# Altium project E17-PDU.PrjPcb
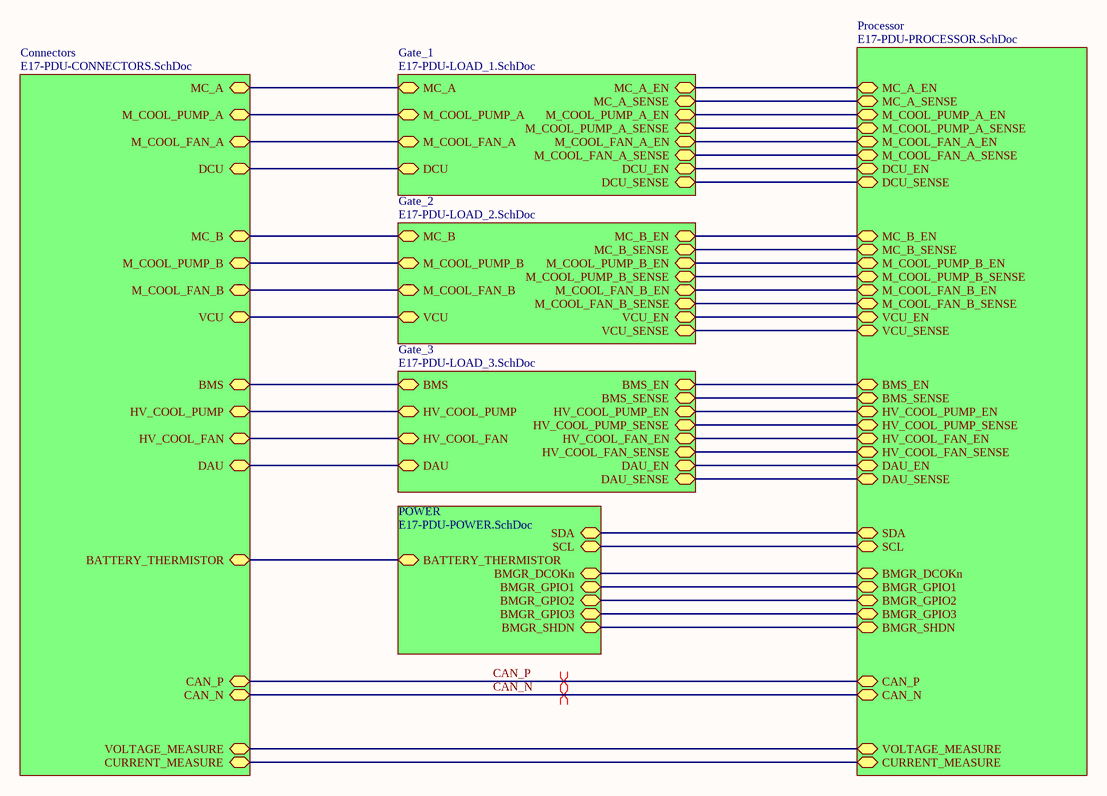
[diagram p0: E17-PDU-MASTER.SchDoc]
7 sheets, 173 parts. Net scope: hierarchical (ports join the sheet entries above them; power ports are global).
Board file: E17-PDU-LAYOUT.PcbDoc
Sheets:
  E17-PDU-MASTER.SchDoc
    Connectors = E17-PDU-CONNECTORS.SchDoc
    Processor = E17-PDU-PROCESSOR.SchDoc
    Gate_1 = E17-PDU-LOAD_1.SchDoc
    Gate_2 = E17-PDU-LOAD_2.SchDoc
    Gate_3 = E17-PDU-LOAD_3.SchDoc
    POWER = E17-PDU-POWER.SchDoc

## Sheet E17-PDU-MASTER.SchDoc
size B

### Sub-sheets
Connectors = E17-PDU-CONNECTORS.SchDoc: MC_A, M_COOL_PUMP_A, M_COOL_FAN_A, MC_B, M_COOL_PUMP_B, DCU, VCU, BMS, CAN_P, CAN_N, VOLTAGE_MEASURE, CURRENT_MEASURE, HV_COOL_PUMP, HV_COOL_FAN, M_COOL_FAN_B, DAU, BATTERY_THERMISTOR
Gate_1 = E17-PDU-LOAD_1.SchDoc: MC_A, M_COOL_PUMP_A, M_COOL_FAN_A, MC_A_EN, M_COOL_PUMP_A_EN, M_COOL_FAN_A_EN, MC_A_SENSE, M_COOL_PUMP_A_SENSE, M_COOL_FAN_A_SENSE, DCU, DCU_EN, DCU_SENSE
Gate_2 = E17-PDU-LOAD_2.SchDoc: MC_B, M_COOL_PUMP_B, MC_B_EN, M_COOL_PUMP_B_EN, MC_B_SENSE, M_COOL_PUMP_B_SENSE, VCU, VCU_EN, VCU_SENSE, M_COOL_FAN_B, M_COOL_FAN_B_EN, M_COOL_FAN_B_SENSE
Gate_3 = E17-PDU-LOAD_3.SchDoc: BMS, BMS_EN, BMS_SENSE, HV_COOL_PUMP_SENSE, HV_COOL_PUMP_EN, HV_COOL_FAN_SENSE, HV_COOL_FAN_EN, HV_COOL_PUMP, HV_COOL_FAN, DAU_EN, DAU, DAU_SENSE
POWER = E17-PDU-POWER.SchDoc: BATTERY_THERMISTOR, BMGR_DCOKn, BMGR_GPIO1, BMGR_GPIO2, BMGR_GPIO3, BMGR_SHDN, SDA, SCL
Processor = E17-PDU-PROCESSOR.SchDoc: MC_A_EN, M_COOL_PUMP_A_EN, M_COOL_FAN_A_EN, M_COOL_FAN_B_EN, MC_B_EN, M_COOL_PUMP_B_EN, DCU_EN, VCU_EN, BMS_EN, VOLTAGE_MEASURE, CURRENT_MEASURE, CAN_P, CAN_N, MC_A_SENSE, M_COOL_PUMP_A_SENSE, M_COOL_FAN_A_SENSE, M_COOL_FAN_B_SENSE, MC_B_SENSE, M_COOL_PUMP_B_SENSE, DCU_SENSE, VCU_SENSE, BMS_SENSE, HV_COOL_PUMP_SENSE, HV_COOL_PUMP_EN, HV_COOL_FAN_SENSE, HV_COOL_FAN_EN, DAU_EN, DAU_SENSE, BMGR_DCOKn, BMGR_GPIO1, BMGR_GPIO2, BMGR_GPIO3, BMGR_SHDN, SCL, SDA

### Nets
CAN_N: sheet Connectors/CAN_N, sheet Processor/CAN_N
CAN_P: sheet Connectors/CAN_P, sheet Processor/CAN_P
NetF5_2: sheet Connectors/MC_A, sheet Gate_1/MC_A
NetF6_2: sheet Connectors/M_COOL_PUMP_A, sheet Gate_1/M_COOL_PUMP_A
NetF7_2: sheet Connectors/M_COOL_FAN_A, sheet Gate_1/M_COOL_FAN_A
NetF8_2: sheet Connectors/DCU, sheet Gate_1/DCU
NetF9_2: sheet Connectors/MC_B, sheet Gate_2/MC_B
NetF10_2: sheet Connectors/M_COOL_PUMP_B, sheet Gate_2/M_COOL_PUMP_B
NetF11_2: sheet Connectors/M_COOL_FAN_B, sheet Gate_2/M_COOL_FAN_B
NetF12_2: sheet Connectors/VCU, sheet Gate_2/VCU
NetF13_2: sheet Connectors/BMS, sheet Gate_3/BMS
NetF14_2: sheet Connectors/HV_COOL_PUMP, sheet Gate_3/HV_COOL_PUMP
NetF15_2: sheet Connectors/HV_COOL_FAN, sheet Gate_3/HV_COOL_FAN
NetF16_2: sheet Connectors/DAU, sheet Gate_3/DAU
NetJ2_34: sheet Connectors/BATTERY_THERMISTOR, sheet POWER/BATTERY_THERMISTOR
NetPB1_16: sheet Connectors/VOLTAGE_MEASURE, sheet Processor/VOLTAGE_MEASURE
NetPB1_18: sheet Processor/MC_B_SENSE, sheet Gate_2/MC_B_SENSE
NetPB1_20: sheet Processor/M_COOL_PUMP_B_SENSE, sheet Gate_2/M_COOL_PUMP_B_SENSE
NetPB1_22: sheet Processor/M_COOL_FAN_B_SENSE, sheet Gate_2/M_COOL_FAN_B_SENSE
NetPB1_24: sheet Processor/VCU_SENSE, sheet Gate_2/VCU_SENSE
NetPB1_25: sheet Connectors/CURRENT_MEASURE, sheet Processor/CURRENT_MEASURE
NetPB1_26: sheet Processor/DCU_SENSE, sheet Gate_1/DCU_SENSE
NetPB1_27: sheet Processor/BMS_SENSE, sheet Gate_3/BMS_SENSE
NetPB1_28: sheet Processor/M_COOL_FAN_A_SENSE, sheet Gate_1/M_COOL_FAN_A_SENSE
NetPB1_29: sheet Processor/HV_COOL_PUMP_SENSE, sheet Gate_3/HV_COOL_PUMP_SENSE
NetPB1_30: sheet Processor/M_COOL_PUMP_A_SENSE, sheet Gate_1/M_COOL_PUMP_A_SENSE
NetPB1_31: sheet Processor/HV_COOL_FAN_SENSE, sheet Gate_3/HV_COOL_FAN_SENSE
NetPB1_32: sheet Processor/MC_A_SENSE, sheet Gate_1/MC_A_SENSE
NetPB1_33: sheet Processor/DAU_SENSE, sheet Gate_3/DAU_SENSE
NetPB1_36: sheet Processor/SCL, sheet POWER/SCL
NetPB1_38: sheet Processor/SDA, sheet POWER/SDA
NetPB1_39: sheet Processor/MC_B_EN, sheet Gate_2/MC_B_EN
NetPB1_40: sheet Processor/BMS_EN, sheet Gate_3/BMS_EN
NetPB1_41: sheet Processor/M_COOL_PUMP_B_EN, sheet Gate_2/M_COOL_PUMP_B_EN
NetPB1_42: sheet Processor/HV_COOL_PUMP_EN, sheet Gate_3/HV_COOL_PUMP_EN
NetPB1_44: sheet Processor/HV_COOL_FAN_EN, sheet Gate_3/HV_COOL_FAN_EN
NetPB1_46: sheet Processor/DAU_EN, sheet Gate_3/DAU_EN
NetPB1_47: sheet Processor/M_COOL_FAN_B_EN, sheet Gate_2/M_COOL_FAN_B_EN
NetPB1_49: sheet Processor/VCU_EN, sheet Gate_2/VCU_EN
NetPB1_53: sheet Processor/MC_A_EN, sheet Gate_1/MC_A_EN
NetPB1_55: sheet Processor/M_COOL_PUMP_A_EN, sheet Gate_1/M_COOL_PUMP_A_EN
NetPB1_56: sheet Processor/BMGR_DCOKn, sheet POWER/BMGR_DCOKn
NetPB1_57: sheet Processor/M_COOL_FAN_A_EN, sheet Gate_1/M_COOL_FAN_A_EN
NetPB1_58: sheet Processor/BMGR_GPIO3, sheet POWER/BMGR_GPIO3
NetPB1_59: sheet Processor/DCU_EN, sheet Gate_1/DCU_EN
NetPB1_60: sheet Processor/BMGR_GPIO2, sheet POWER/BMGR_GPIO2
NetPB1_62: sheet Processor/BMGR_GPIO1, sheet POWER/BMGR_GPIO1
NetPB1_64: sheet Processor/BMGR_SHDN, sheet POWER/BMGR_SHDN

### Layout directives
differential pair: CAN_N, CAN_P

## Sheet E17-PDU-CONNECTORS.SchDoc
size A3
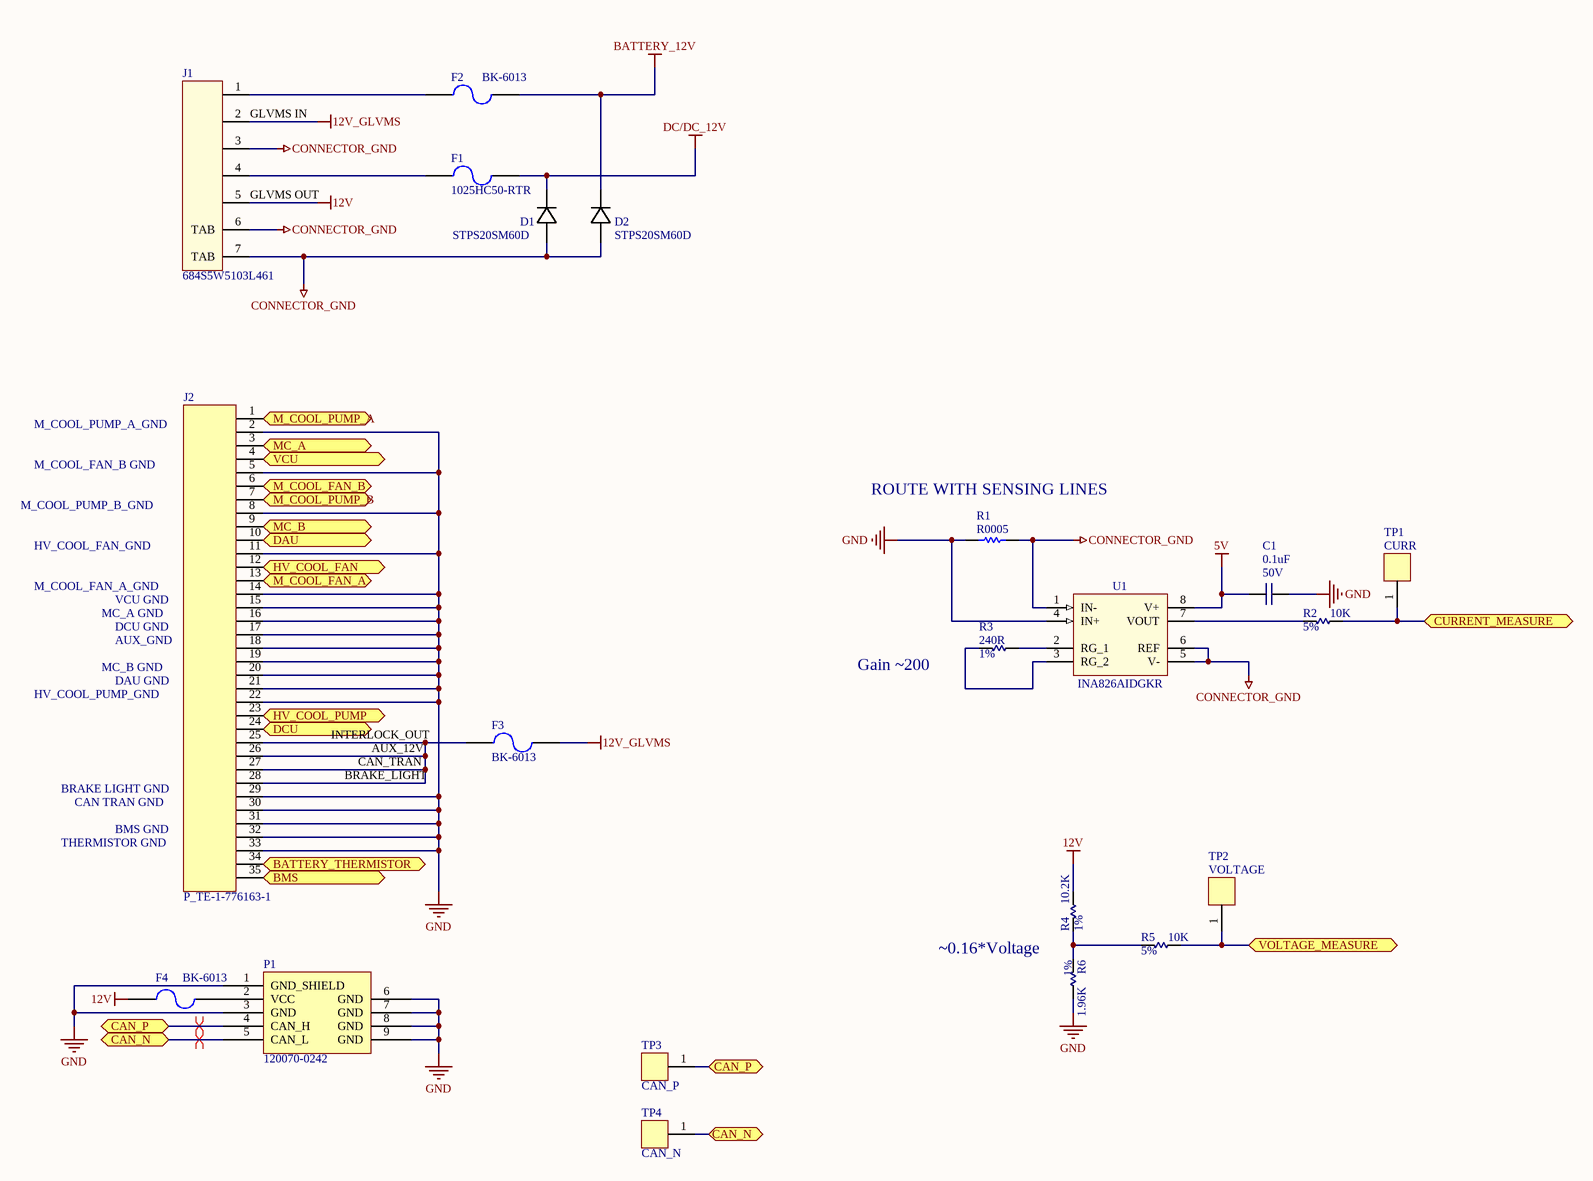
[diagram p1: E17-PDU-CONNECTORS.SchDoc]

### Parts
C1  value 0.1uF  Voltage: 50V  [C0805]  (hidden comment: C_0805_Generic)
D1  MFG_PN: STPS20SM60D  [TO-220-2]  (hidden comment: D_STPS20SM60D)
D2  MFG_PN: STPS20SM60D  [TO-220-2]  (hidden comment: D_STPS20SM60D)
F1  MFG_PN: 1025HC50-RTR  [F_1025HC50-RTR]  (hidden comment: F_1025HC50-RTR)
F2  F_BK-6013  [BK-6013]  (value not drawn)
F3  F_BK-6013  [BK-6013]  (value not drawn)
F4  F_BK-6013  [BK-6013]  (value not drawn)
J1  MFG_PN: 684S5W5103L461  [J_684S5W5103L461]  (hidden comment: J_684S5W5103L461)
J2  P_TE-1-776163-1  [P_TE-1-776163-1]
P1  MFG_PN: 120070-0242  [CAN Connector (90)]  (hidden comment: P_CAN-CONNECTOR)
R1  value R0005  [PSR500HTQFC0L20]  (hidden comment: R_PSR500HTQFC0L20)
R2  value 10K  Tolerance: 5%  [R0805]  (hidden comment: R_0805_Generic)
R3  value 240R  Tolerance: 1%  [R0805]  (hidden comment: R_0805_Generic)
R4  value 10.2K  Tolerance: 1%  [R0805]  (hidden comment: R_0805_Generic)
R5  value 10K  Tolerance: 5%  [R0805]  (hidden comment: R_0805_Generic)
R6  value 1.96K  Tolerance: 1%  [R0805]  (hidden comment: R_0805_Generic)
TP1  CURR  [TEST POINT]
TP2  VOLTAGE  [TEST POINT]
TP3  CAN_P  [TEST POINT]
TP4  CAN_N  [TEST POINT]
U1  value INA826AIDGKR  [8-TSSOP]  (hidden comment: U_INA826AIDGKR)

### Ports
BATTERY_THERMISTOR, BMS, CAN_N, CAN_P, CURRENT_MEASURE, DAU, DCU, HV_COOL_FAN, HV_COOL_PUMP, M_COOL_FAN_A, M_COOL_FAN_B, M_COOL_PUMP_A, M_COOL_PUMP_B, MC_A, MC_B, VCU, VOLTAGE_MEASURE

### Nets
5V: C1.2 U1.8(V+)
12V: F4.2 J1.5 R4.2
12V_GLVMS: F3.2 J1.2
BATTERY_12V: D2.2 F2.2
CONNECTOR_GND: D1.1 D2.1 J1.3 J1.6(TAB) J1.7(TAB) R1.2 U1.1(IN-) U1.5(V-) U1.6(REF)
DC/DC_12V: D1.2 F1.2
GND: C1.1(EGND) J2.2 J2.5 J2.8 J2.11 J2.14 J2.15 J2.16 J2.17 J2.18 J2.19 J2.20 J2.21 J2.22 J2.29 J2.30 J2.31 J2.32 J2.33 P1.1(GND_SHIELD) P1.3(GND) P1.6(GND) P1.7(GND) P1.8(GND) P1.9(GND) R1.1 R6.2 U1.4(IN+)
CAN_N: P1.5(CAN_L) TP4.1 ; port CAN_N
CAN_P: P1.4(CAN_H) TP3.1 ; port CAN_P
NetF1_1: F1.1 J1.4
NetF2_1: F2.1 J1.1
NetF3_1: F3.1 J2.25 J2.26 J2.27 J2.28
NetF4_1: F4.1 P1.2(VCC)
NetF5_2: J2.3 ; port MC_A
NetF6_2: J2.1 ; port M_COOL_PUMP_A
NetF7_2: J2.13 ; port M_COOL_FAN_A
NetF8_2: J2.24 ; port DCU
NetF9_2: J2.9 ; port MC_B
NetF10_2: J2.7 ; port M_COOL_PUMP_B
NetF11_2: J2.6 ; port M_COOL_FAN_B
NetF12_2: J2.4 ; port VCU
NetF13_2: J2.35 ; port BMS
NetF14_2: J2.23 ; port HV_COOL_PUMP
NetF15_2: J2.12 ; port HV_COOL_FAN
NetF16_2: J2.10 ; port DAU
NetJ2_34: J2.34 ; port BATTERY_THERMISTOR
NetPB1_16: R5.2 TP2.1 ; port VOLTAGE_MEASURE
NetPB1_25: R2.2 TP1.1 ; port CURRENT_MEASURE
NetR2_1: R2.1 U1.7(VOUT)
NetR3_1: R3.1 U1.3(RG_2)
NetR3_2: R3.2 U1.2(RG_1)
NetR4_1: R4.1 R5.1 R6.1

### Layout directives
differential pair: CAN_N, CAN_P

### Notes on the sheet
- (near J1) GLVMS IN
- (near J1) GLVMS OUT
- M_COOL_FAN_B GND
- M_COOL_PUMP_A_GND
- M_COOL_PUMP_B_GND
- (near R1) ROUTE WITH SENSING LINES
- HV_COOL_FAN_GND
- M_COOL_FAN_A_GND
- VCU GND
- MC_A GND
- MC_B GND
- DCU GND
- AUX_GND
- Gain ~200
- HV_COOL_PUMP_GND
- DAU GND
- INTERLOCK_OUT
- BRAKE LIGHT GND
- CAN TRAN GND
- BRAKE_LIGHT
- CAN_TRAN
- AUX_12V
- THERMISTOR GND
- BMS GND
- ~0.16*Voltage

### Library data of the parts
C1 = C_0805_Generic: Generic 0805 Capacitor; Tolerance: 10%; Supplier: Digikey; Supplier_PN: 399-1170-1-ND
D1 D2 = D_STPS20SM60D: DIODE 630mV 20A cts 60V; MFG: ST; Supplier: Digikey; Supplier_PN: 497-12305-ND
F1 = F_1025HC50-RTR: FUSE 50A 60VDC; MFG: Eaton; Supplier: Digikey; Supplier_PN: 283-4682-1-ND
F2-F4 = F_BK-6013: FUSE HOLDER BLADE PCB; MFG: MPD; Supplier: Digikey; Supplier_PN: BK-6013-ND; MFG_PN: BK-6013
J1 = J_684S5W5103L461: D-Sub 5-pin 40A RA TH; MFG: NorComp; Supplier: Digikey; Supplier_PN: NOR1213-ND
J2 = P_TE-1-776163-1: CONN HEADER 35POS R/A GOLD BLACK; MFG: TE; Supplier_PN: A106383-ND; Supplier: Digikey; MFG_PN: 1-776163-1
P1 = P_CAN-CONNECTOR: MFG: MOLEX
R1 = R_PSR500HTQFC0L20: Resistor 0.0002ohm 5W Current Sense; MFG: Rohm; MFG_PN: PSR500HTQFC0L20; Supplier: Digikey; Supplier_PN: RHM1679-CT-ND
R2-R6 = R_0805_Generic: Generic 0805 Resistor; Power: 1/8W; Supplier: Digikey
  R2 R5: Supplier_PN: P10KACT-ND
  R3: Supplier_PN: P240CCT-ND
  R4: Supplier_PN: P10.2KCCT-ND
  R6: Supplier_PN: P1.96KCCT-ND
TP1-TP4 = Test Point
U1 = U_INA826AIDGKR: Opamp Instrumentation 2.7-36V SS; MFG: TI; MFG_PN: INA826AIDGKR; Supplier 1: Digi-Key; Supplier Part Number 1: 296-29663-1-ND

## Sheet E17-PDU-PROCESSOR.SchDoc
size A4
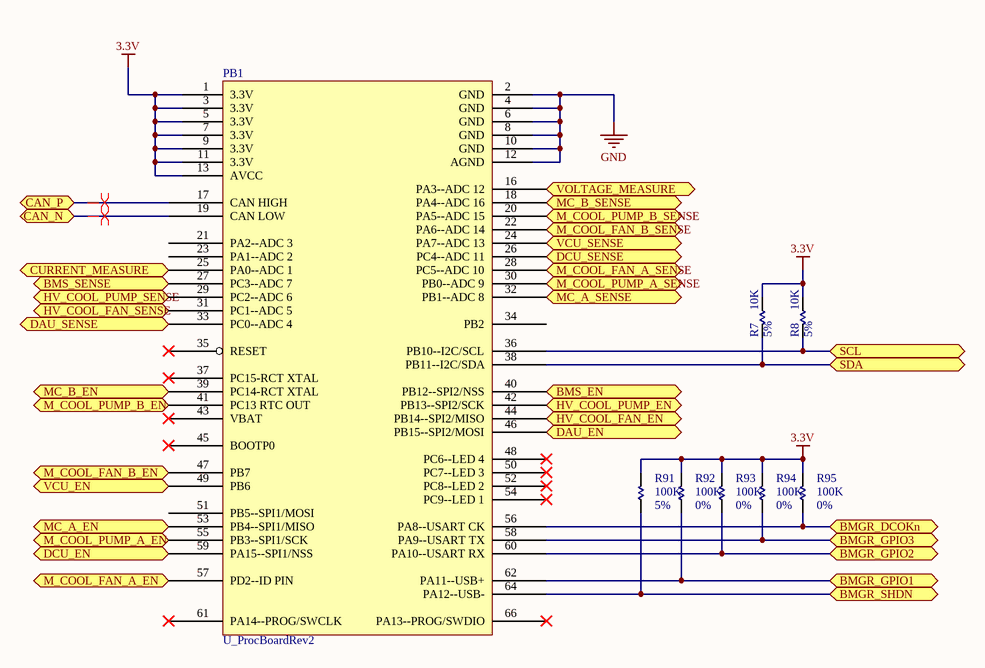
[diagram p2: E17-PDU-PROCESSOR.SchDoc]

### Parts
PB1  U_ProcBoardRev2  [PROC_BOARD]
R7  value 10K  Tolerance: 5%  [R0603]  (hidden comment: R_0603_Generic)
R8  value 10K  Tolerance: 5%  [R0603]  (hidden comment: R_0603_Generic)
R91  value 100K  Tolerance: 5%  [R0603]  (hidden comment: R_0603_Generic)
R92  value 100K  Tolerance: 0%  [R0603]  (hidden comment: R_0603_Generic)
R93  value 100K  Tolerance: 0%  [R0603]  (hidden comment: R_0603_Generic)
R94  value 100K  Tolerance: 0%  [R0603]  (hidden comment: R_0603_Generic)
R95  value 100K  Tolerance: 0%  [R0603]  (hidden comment: R_0603_Generic)

### Ports
BMGR_DCOKn, BMGR_GPIO1, BMGR_GPIO2, BMGR_GPIO3, BMGR_SHDN, BMS_EN, BMS_SENSE, CAN_N, CAN_P, CURRENT_MEASURE, DAU_EN, DAU_SENSE, DCU_EN, DCU_SENSE, HV_COOL_FAN_EN, HV_COOL_FAN_SENSE, HV_COOL_PUMP_EN, HV_COOL_PUMP_SENSE, M_COOL_FAN_A_EN, M_COOL_FAN_A_SENSE, M_COOL_FAN_B_EN, M_COOL_FAN_B_SENSE, M_COOL_PUMP_A_EN, M_COOL_PUMP_A_SENSE, M_COOL_PUMP_B_EN, M_COOL_PUMP_B_SENSE, MC_A_EN, MC_A_SENSE, MC_B_EN, MC_B_SENSE, SCL, SDA, VCU_EN, VCU_SENSE, VOLTAGE_MEASURE

### Nets
3.3V: PB1.1(3.3V) PB1.3(3.3V) PB1.5(3.3V) PB1.7(3.3V) PB1.9(3.3V) PB1.11(3.3V) PB1.13(AVCC) R7.2 R8.2 R91.1 R92.1 R93.1 R94.1 R95.1
GND: PB1.2(GND) PB1.4(GND) PB1.6(GND) PB1.8(GND) PB1.10(GND) PB1.12(AGND)
CAN_N: PB1.19(CAN_LOW) ; port CAN_N
CAN_P: PB1.17(CAN_HIGH) ; port CAN_P
NetPB1_16: PB1.16(PA3--ADC_12) ; port VOLTAGE_MEASURE
NetPB1_18: PB1.18(PA4--ADC_16) ; port MC_B_SENSE
NetPB1_20: PB1.20(PA5--ADC_15) ; port M_COOL_PUMP_B_SENSE
NetPB1_22: PB1.22(PA6--ADC_14) ; port M_COOL_FAN_B_SENSE
NetPB1_24: PB1.24(PA7--ADC_13) ; port VCU_SENSE
NetPB1_25: PB1.25(PA0--ADC_1) ; port CURRENT_MEASURE
NetPB1_26: PB1.26(PC4--ADC_11) ; port DCU_SENSE
NetPB1_27: PB1.27(PC3--ADC_7) ; port BMS_SENSE
NetPB1_28: PB1.28(PC5--ADC_10) ; port M_COOL_FAN_A_SENSE
NetPB1_29: PB1.29(PC2--ADC_6) ; port HV_COOL_PUMP_SENSE
NetPB1_30: PB1.30(PB0--ADC_9) ; port M_COOL_PUMP_A_SENSE
NetPB1_31: PB1.31(PC1--ADC_5) ; port HV_COOL_FAN_SENSE
NetPB1_32: PB1.32(PB1--ADC_8) ; port MC_A_SENSE
NetPB1_33: PB1.33(PC0--ADC_4) ; port DAU_SENSE
NetPB1_36: PB1.36(PB10--I2C/SCL) R8.1 ; port SCL
NetPB1_38: PB1.38(PB11--I2C/SDA) R7.1 ; port SDA
NetPB1_39: PB1.39(PC14-RCT_XTAL) ; port MC_B_EN
NetPB1_40: PB1.40(PB12--SPI2/NSS) ; port BMS_EN
NetPB1_41: PB1.41(PC13_RTC_OUT) ; port M_COOL_PUMP_B_EN
NetPB1_42: PB1.42(PB13--SPI2/SCK) ; port HV_COOL_PUMP_EN
NetPB1_44: PB1.44(PB14--SPI2/MISO) ; port HV_COOL_FAN_EN
NetPB1_46: PB1.46(PB15--SPI2/MOSI) ; port DAU_EN
NetPB1_47: PB1.47(PB7) ; port M_COOL_FAN_B_EN
NetPB1_49: PB1.49(PB6) ; port VCU_EN
NetPB1_53: PB1.53(PB4--SPI1/MISO) ; port MC_A_EN
NetPB1_55: PB1.55(PB3--SPI1/SCK) ; port M_COOL_PUMP_A_EN
NetPB1_56: PB1.56(PA8--USART_CK) R95.2 ; port BMGR_DCOKn
NetPB1_57: PB1.57(PD2--ID_PIN) ; port M_COOL_FAN_A_EN
NetPB1_58: PB1.58(PA9--USART_TX) R94.2 ; port BMGR_GPIO3
NetPB1_59: PB1.59(PA15--SPI1/NSS) ; port DCU_EN
NetPB1_60: PB1.60(PA10--USART_RX) R93.2 ; port BMGR_GPIO2
NetPB1_62: PB1.62(PA11--USB+) R92.2 ; port BMGR_GPIO1
NetPB1_64: PB1.64(PA12--USB-) R91.2 ; port BMGR_SHDN

Not connected (* = marked no-connect by the designer): PB1 14(NC) 15(NC) 21(PA2--ADC_3) 23(PA1--ADC_2) 34(PB2) 35(RESET)* 37(PC15-RCT_XTAL)* 43(VBAT)* 45(BOOTP0)* 48(PC6--LED_4)* 50(PC7--LED_3)* 51(PB5--SPI1/MOSI) 52(PC8--LED_2)* 54(PC9--LED_1)* 61(PA14--PROG/SWCLK)* 63(NC) 65(NC) 66(PA13--PROG/SWDIO)* 67

### Layout directives
differential pair: CAN_N, CAN_P

### Library data of the parts
PB1 = U_ProcBoardRev2: Processor board that carries the STM32F072RB
R7 R8 = R_0603_Generic: Generic 0603 Resistor; Power: 1/10W; Supplier: Digikey; Supplier_PN: P10KGCT-ND
R91-R95 = R_0603_Generic: Generic 0603 Resistor; Power: 0W; Supplier: Digikey; Supplier_PN: 000-00-00-ND

## Sheet E17-PDU-LOAD_1.SchDoc
size A4
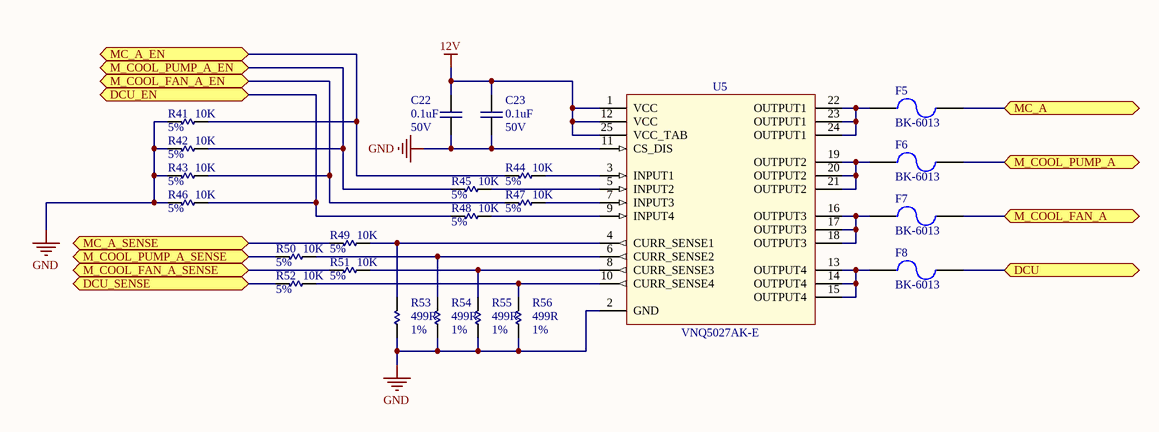
[diagram p3: E17-PDU-LOAD_1.SchDoc]

### Parts
C22  value 0.1uF  Voltage: 50V  [C0805]  (hidden comment: C_0805_Generic)
C23  value 0.1uF  Voltage: 50V  [C0805]  (hidden comment: C_0805_Generic)
F5  F_BK-6013  [BK-6013]  (value not drawn)
F6  F_BK-6013  [BK-6013]  (value not drawn)
F7  F_BK-6013  [BK-6013]  (value not drawn)
F8  F_BK-6013  [BK-6013]  (value not drawn)
R41  value 10K  Tolerance: 5%  [R0603]  (hidden comment: R_0603_Generic)
R42  value 10K  Tolerance: 5%  [R0603]  (hidden comment: R_0603_Generic)
R43  value 10K  Tolerance: 5%  [R0603]  (hidden comment: R_0603_Generic)
R44  value 10K  Tolerance: 5%  [R0603]  (hidden comment: R_0603_Generic)
R45  value 10K  Tolerance: 5%  [R0603]  (hidden comment: R_0603_Generic)
R46  value 10K  Tolerance: 5%  [R0603]  (hidden comment: R_0603_Generic)
R47  value 10K  Tolerance: 5%  [R0603]  (hidden comment: R_0603_Generic)
R48  value 10K  Tolerance: 5%  [R0603]  (hidden comment: R_0603_Generic)
R49  value 10K  Tolerance: 5%  [R0603]  (hidden comment: R_0603_Generic)
R50  value 10K  Tolerance: 5%  [R0603]  (hidden comment: R_0603_Generic)
R51  value 10K  Tolerance: 5%  [R0603]  (hidden comment: R_0603_Generic)
R52  value 10K  Tolerance: 5%  [R0603]  (hidden comment: R_0603_Generic)
R53  value 499R  Tolerance: 1%  [R0603]  (hidden comment: R_0603_Generic)
R54  value 499R  Tolerance: 1%  [R0603]  (hidden comment: R_0603_Generic)
R55  value 499R  Tolerance: 1%  [R0603]  (hidden comment: R_0603_Generic)
R56  value 499R  Tolerance: 1%  [R0603]  (hidden comment: R_0603_Generic)
U5  MFG_PN: VNQ5027AK-E  [PowerSSO-24]  (hidden comment: U_VNQ5027AK-E)

### Ports
DCU, DCU_EN, DCU_SENSE, M_COOL_FAN_A, M_COOL_FAN_A_EN, M_COOL_FAN_A_SENSE, M_COOL_PUMP_A, M_COOL_PUMP_A_EN, M_COOL_PUMP_A_SENSE, MC_A, MC_A_EN, MC_A_SENSE

### Nets
12V: C22.1(EGND) C23.1(EGND) U5.1(VCC) U5.12(VCC) U5.25(VCC_TAB)
GND: C22.2 C23.2 R41.1 R42.1 R43.1 R46.1 R53.2 R54.2 R55.2 R56.2 U5.2(GND) U5.11(CS_DIS)
NetF5_1: F5.1 U5.22(OUTPUT1) U5.23(OUTPUT1) U5.24(OUTPUT1)
NetF5_2: F5.2 ; port MC_A
NetF6_1: F6.1 U5.19(OUTPUT2) U5.20(OUTPUT2) U5.21(OUTPUT2)
NetF6_2: F6.2 ; port M_COOL_PUMP_A
NetF7_1: F7.1 U5.16(OUTPUT3) U5.17(OUTPUT3) U5.18(OUTPUT3)
NetF7_2: F7.2 ; port M_COOL_FAN_A
NetF8_1: F8.1 U5.13(OUTPUT4) U5.14(OUTPUT4) U5.15(OUTPUT4)
NetF8_2: F8.2 ; port DCU
NetPB1_26: R52.1 ; port DCU_SENSE
NetPB1_28: R51.1 ; port M_COOL_FAN_A_SENSE
NetPB1_30: R50.1 ; port M_COOL_PUMP_A_SENSE
NetPB1_32: R49.1 ; port MC_A_SENSE
NetPB1_53: R41.2 R44.1 ; port MC_A_EN
NetPB1_55: R42.2 R45.1 ; port M_COOL_PUMP_A_EN
NetPB1_57: R43.2 R47.1 ; port M_COOL_FAN_A_EN
NetPB1_59: R46.2 R48.1 ; port DCU_EN
NetR44_2: R44.2 U5.3(INPUT1)
NetR45_2: R45.2 U5.5(INPUT2)
NetR47_2: R47.2 U5.7(INPUT3)
NetR48_2: R48.2 U5.9(INPUT4)
NetR49_2: R49.2 R53.1 U5.4(CURR_SENSE1)
NetR50_2: R50.2 R54.1 U5.6(CURR_SENSE2)
NetR51_2: R51.2 R55.1 U5.8(CURR_SENSE3)
NetR52_2: R52.2 R56.1 U5.10(CURR_SENSE4)

### Library data of the parts
C22 C23 = C_0805_Generic: Generic 0805 Capacitor; Tolerance: 10%; Supplier: Digikey; Supplier_PN: 399-1170-1-ND
F5-F8 = F_BK-6013: FUSE HOLDER BLADE PCB; MFG: MPD; Supplier: Digikey; Supplier_PN: BK-6013-ND; MFG_PN: BK-6013
R41-R52 = R_0603_Generic: Generic 0603 Resistor; Power: 1/10W; Supplier: Digikey; Supplier_PN: P10KGCT-ND
R53-R56 = R_0603_Generic: Generic 0603 Resistor; Power: 1/8W; Supplier: Digikey; Supplier_PN: RNCP0603FTD499RCT-ND
U5 = U_VNQ5027AK-E: LOAD CHANNEL HIGH SIDE 42A 4 Channel; MFG: STmicroelectronics; Supplier_PN: 497-11715-1-ND; Supplier: Digikey

## Sheet E17-PDU-LOAD_2.SchDoc
size A4
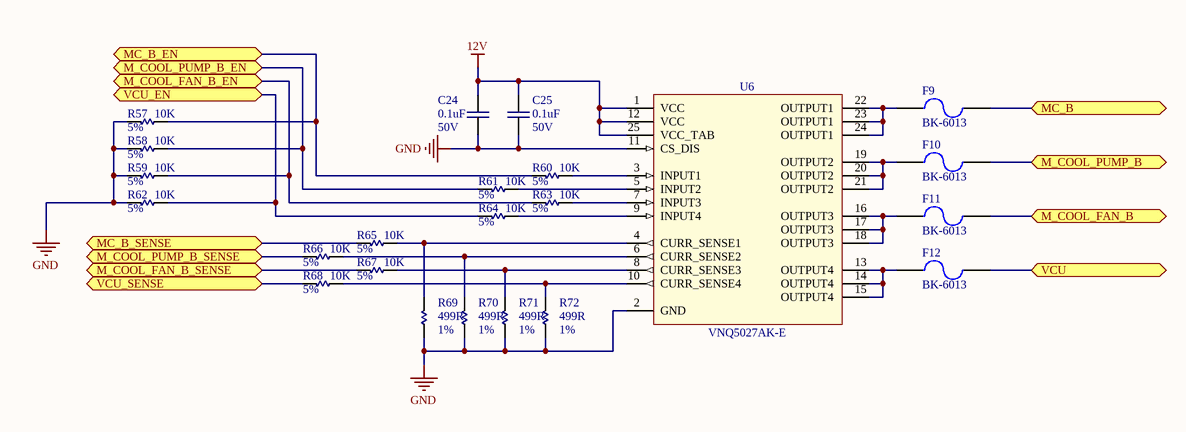
[diagram p4: E17-PDU-LOAD_2.SchDoc]

### Parts
C24  value 0.1uF  Voltage: 50V  [C0805]  (hidden comment: C_0805_Generic)
C25  value 0.1uF  Voltage: 50V  [C0805]  (hidden comment: C_0805_Generic)
F9  F_BK-6013  [BK-6013]  (value not drawn)
F10  F_BK-6013  [BK-6013]  (value not drawn)
F11  F_BK-6013  [BK-6013]  (value not drawn)
F12  F_BK-6013  [BK-6013]  (value not drawn)
R57  value 10K  Tolerance: 5%  [R0603]  (hidden comment: R_0603_Generic)
R58  value 10K  Tolerance: 5%  [R0603]  (hidden comment: R_0603_Generic)
R59  value 10K  Tolerance: 5%  [R0603]  (hidden comment: R_0603_Generic)
R60  value 10K  Tolerance: 5%  [R0603]  (hidden comment: R_0603_Generic)
R61  value 10K  Tolerance: 5%  [R0603]  (hidden comment: R_0603_Generic)
R62  value 10K  Tolerance: 5%  [R0603]  (hidden comment: R_0603_Generic)
R63  value 10K  Tolerance: 5%  [R0603]  (hidden comment: R_0603_Generic)
R64  value 10K  Tolerance: 5%  [R0603]  (hidden comment: R_0603_Generic)
R65  value 10K  Tolerance: 5%  [R0603]  (hidden comment: R_0603_Generic)
R66  value 10K  Tolerance: 5%  [R0603]  (hidden comment: R_0603_Generic)
R67  value 10K  Tolerance: 5%  [R0603]  (hidden comment: R_0603_Generic)
R68  value 10K  Tolerance: 5%  [R0603]  (hidden comment: R_0603_Generic)
R69  value 499R  Tolerance: 1%  [R0603]  (hidden comment: R_0603_Generic)
R70  value 499R  Tolerance: 1%  [R0603]  (hidden comment: R_0603_Generic)
R71  value 499R  Tolerance: 1%  [R0603]  (hidden comment: R_0603_Generic)
R72  value 499R  Tolerance: 1%  [R0603]  (hidden comment: R_0603_Generic)
U6  MFG_PN: VNQ5027AK-E  [PowerSSO-24]  (hidden comment: U_VNQ5027AK-E)

### Ports
M_COOL_FAN_B, M_COOL_FAN_B_EN, M_COOL_FAN_B_SENSE, M_COOL_PUMP_B, M_COOL_PUMP_B_EN, M_COOL_PUMP_B_SENSE, MC_B, MC_B_EN, MC_B_SENSE, VCU, VCU_EN, VCU_SENSE

### Nets
12V: C24.1(EGND) C25.1(EGND) U6.1(VCC) U6.12(VCC) U6.25(VCC_TAB)
GND: C24.2 C25.2 R57.1 R58.1 R59.1 R62.1 R69.2 R70.2 R71.2 R72.2 U6.2(GND) U6.11(CS_DIS)
NetF9_1: F9.1 U6.22(OUTPUT1) U6.23(OUTPUT1) U6.24(OUTPUT1)
NetF9_2: F9.2 ; port MC_B
NetF10_1: F10.1 U6.19(OUTPUT2) U6.20(OUTPUT2) U6.21(OUTPUT2)
NetF10_2: F10.2 ; port M_COOL_PUMP_B
NetF11_1: F11.1 U6.16(OUTPUT3) U6.17(OUTPUT3) U6.18(OUTPUT3)
NetF11_2: F11.2 ; port M_COOL_FAN_B
NetF12_1: F12.1 U6.13(OUTPUT4) U6.14(OUTPUT4) U6.15(OUTPUT4)
NetF12_2: F12.2 ; port VCU
NetPB1_18: R65.1 ; port MC_B_SENSE
NetPB1_20: R66.1 ; port M_COOL_PUMP_B_SENSE
NetPB1_22: R67.1 ; port M_COOL_FAN_B_SENSE
NetPB1_24: R68.1 ; port VCU_SENSE
NetPB1_39: R57.2 R60.1 ; port MC_B_EN
NetPB1_41: R58.2 R61.1 ; port M_COOL_PUMP_B_EN
NetPB1_47: R59.2 R63.1 ; port M_COOL_FAN_B_EN
NetPB1_49: R62.2 R64.1 ; port VCU_EN
NetR60_2: R60.2 U6.3(INPUT1)
NetR61_2: R61.2 U6.5(INPUT2)
NetR63_2: R63.2 U6.7(INPUT3)
NetR64_2: R64.2 U6.9(INPUT4)
NetR65_2: R65.2 R69.1 U6.4(CURR_SENSE1)
NetR66_2: R66.2 R70.1 U6.6(CURR_SENSE2)
NetR67_2: R67.2 R71.1 U6.8(CURR_SENSE3)
NetR68_2: R68.2 R72.1 U6.10(CURR_SENSE4)

### Library data of the parts
C24 C25 = C_0805_Generic: Generic 0805 Capacitor; Tolerance: 10%; Supplier: Digikey; Supplier_PN: 399-1170-1-ND
F9-F12 = F_BK-6013: FUSE HOLDER BLADE PCB; MFG: MPD; Supplier: Digikey; Supplier_PN: BK-6013-ND; MFG_PN: BK-6013
R57-R68 = R_0603_Generic: Generic 0603 Resistor; Power: 1/10W; Supplier: Digikey; Supplier_PN: P10KGCT-ND
R69-R72 = R_0603_Generic: Generic 0603 Resistor; Power: 1/8W; Supplier: Digikey; Supplier_PN: RNCP0603FTD499RCT-ND
U6 = U_VNQ5027AK-E: as U5 on sheet E17-PDU-LOAD_1; Supplier_PN: 497-11715-1-ND; Supplier: Digikey

## Sheet E17-PDU-LOAD_3.SchDoc
size A4
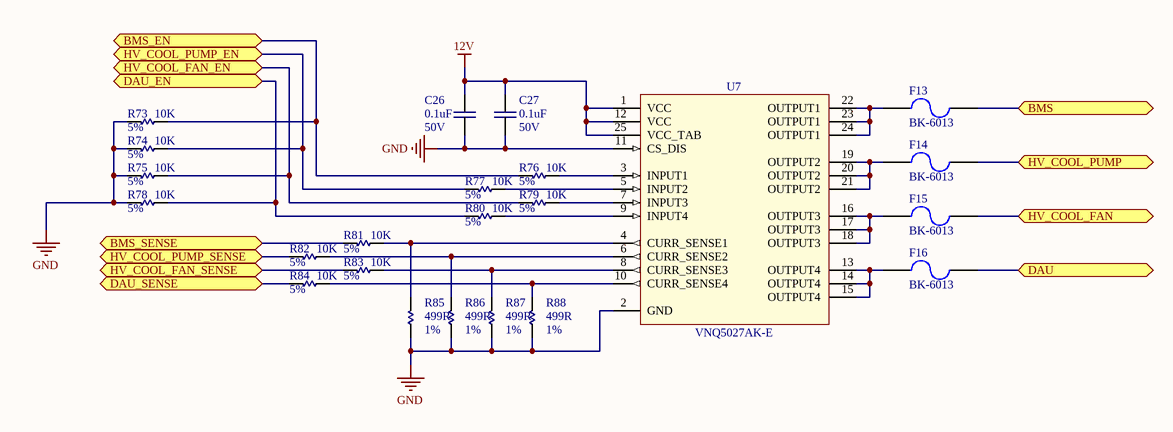
[diagram p5: E17-PDU-LOAD_3.SchDoc]

### Parts
C26  value 0.1uF  Voltage: 50V  [C0805]  (hidden comment: C_0805_Generic)
C27  value 0.1uF  Voltage: 50V  [C0805]  (hidden comment: C_0805_Generic)
F13  F_BK-6013  [BK-6013]  (value not drawn)
F14  F_BK-6013  [BK-6013]  (value not drawn)
F15  F_BK-6013  [BK-6013]  (value not drawn)
F16  F_BK-6013  [BK-6013]  (value not drawn)
R73  value 10K  Tolerance: 5%  [R0603]  (hidden comment: R_0603_Generic)
R74  value 10K  Tolerance: 5%  [R0603]  (hidden comment: R_0603_Generic)
R75  value 10K  Tolerance: 5%  [R0603]  (hidden comment: R_0603_Generic)
R76  value 10K  Tolerance: 5%  [R0603]  (hidden comment: R_0603_Generic)
R77  value 10K  Tolerance: 5%  [R0603]  (hidden comment: R_0603_Generic)
R78  value 10K  Tolerance: 5%  [R0603]  (hidden comment: R_0603_Generic)
R79  value 10K  Tolerance: 5%  [R0603]  (hidden comment: R_0603_Generic)
R80  value 10K  Tolerance: 5%  [R0603]  (hidden comment: R_0603_Generic)
R81  value 10K  Tolerance: 5%  [R0603]  (hidden comment: R_0603_Generic)
R82  value 10K  Tolerance: 5%  [R0603]  (hidden comment: R_0603_Generic)
R83  value 10K  Tolerance: 5%  [R0603]  (hidden comment: R_0603_Generic)
R84  value 10K  Tolerance: 5%  [R0603]  (hidden comment: R_0603_Generic)
R85  value 499R  Tolerance: 1%  [R0603]  (hidden comment: R_0603_Generic)
R86  value 499R  Tolerance: 1%  [R0603]  (hidden comment: R_0603_Generic)
R87  value 499R  Tolerance: 1%  [R0603]  (hidden comment: R_0603_Generic)
R88  value 499R  Tolerance: 1%  [R0603]  (hidden comment: R_0603_Generic)
U7  MFG_PN: VNQ5027AK-E  [PowerSSO-24]  (hidden comment: U_VNQ5027AK-E)

### Ports
BMS, BMS_EN, BMS_SENSE, DAU, DAU_EN, DAU_SENSE, HV_COOL_FAN, HV_COOL_FAN_EN, HV_COOL_FAN_SENSE, HV_COOL_PUMP, HV_COOL_PUMP_EN, HV_COOL_PUMP_SENSE

### Nets
12V: C26.1(EGND) C27.1(EGND) U7.1(VCC) U7.12(VCC) U7.25(VCC_TAB)
GND: C26.2 C27.2 R73.1 R74.1 R75.1 R78.1 R85.2 R86.2 R87.2 R88.2 U7.2(GND) U7.11(CS_DIS)
NetF13_1: F13.1 U7.22(OUTPUT1) U7.23(OUTPUT1) U7.24(OUTPUT1)
NetF13_2: F13.2 ; port BMS
NetF14_1: F14.1 U7.19(OUTPUT2) U7.20(OUTPUT2) U7.21(OUTPUT2)
NetF14_2: F14.2 ; port HV_COOL_PUMP
NetF15_1: F15.1 U7.16(OUTPUT3) U7.17(OUTPUT3) U7.18(OUTPUT3)
NetF15_2: F15.2 ; port HV_COOL_FAN
NetF16_1: F16.1 U7.13(OUTPUT4) U7.14(OUTPUT4) U7.15(OUTPUT4)
NetF16_2: F16.2 ; port DAU
NetPB1_27: R81.1 ; port BMS_SENSE
NetPB1_29: R82.1 ; port HV_COOL_PUMP_SENSE
NetPB1_31: R83.1 ; port HV_COOL_FAN_SENSE
NetPB1_33: R84.1 ; port DAU_SENSE
NetPB1_40: R73.2 R76.1 ; port BMS_EN
NetPB1_42: R74.2 R77.1 ; port HV_COOL_PUMP_EN
NetPB1_44: R75.2 R79.1 ; port HV_COOL_FAN_EN
NetPB1_46: R78.2 R80.1 ; port DAU_EN
NetR76_2: R76.2 U7.3(INPUT1)
NetR77_2: R77.2 U7.5(INPUT2)
NetR79_2: R79.2 U7.7(INPUT3)
NetR80_2: R80.2 U7.9(INPUT4)
NetR81_2: R81.2 R85.1 U7.4(CURR_SENSE1)
NetR82_2: R82.2 R86.1 U7.6(CURR_SENSE2)
NetR83_2: R83.2 R87.1 U7.8(CURR_SENSE3)
NetR84_2: R84.2 R88.1 U7.10(CURR_SENSE4)

### Library data of the parts
C26 C27 = C_0805_Generic: Generic 0805 Capacitor; Tolerance: 10%; Supplier: Digikey; Supplier_PN: 399-1170-1-ND
F13-F16 = F_BK-6013: FUSE HOLDER BLADE PCB; MFG: MPD; Supplier: Digikey; Supplier_PN: BK-6013-ND; MFG_PN: BK-6013
R73-R84 = R_0603_Generic: Generic 0603 Resistor; Power: 1/10W; Supplier: Digikey; Supplier_PN: P10KGCT-ND
R85-R88 = R_0603_Generic: Generic 0603 Resistor; Power: 1/8W; Supplier: Digikey; Supplier_PN: RNCP0603FTD499RCT-ND
U7 = U_VNQ5027AK-E: as U5 on sheet E17-PDU-LOAD_1; Supplier_PN: 497-11715-1-ND; Supplier: Digikey

## Sheet E17-PDU-POWER.SchDoc
size A2
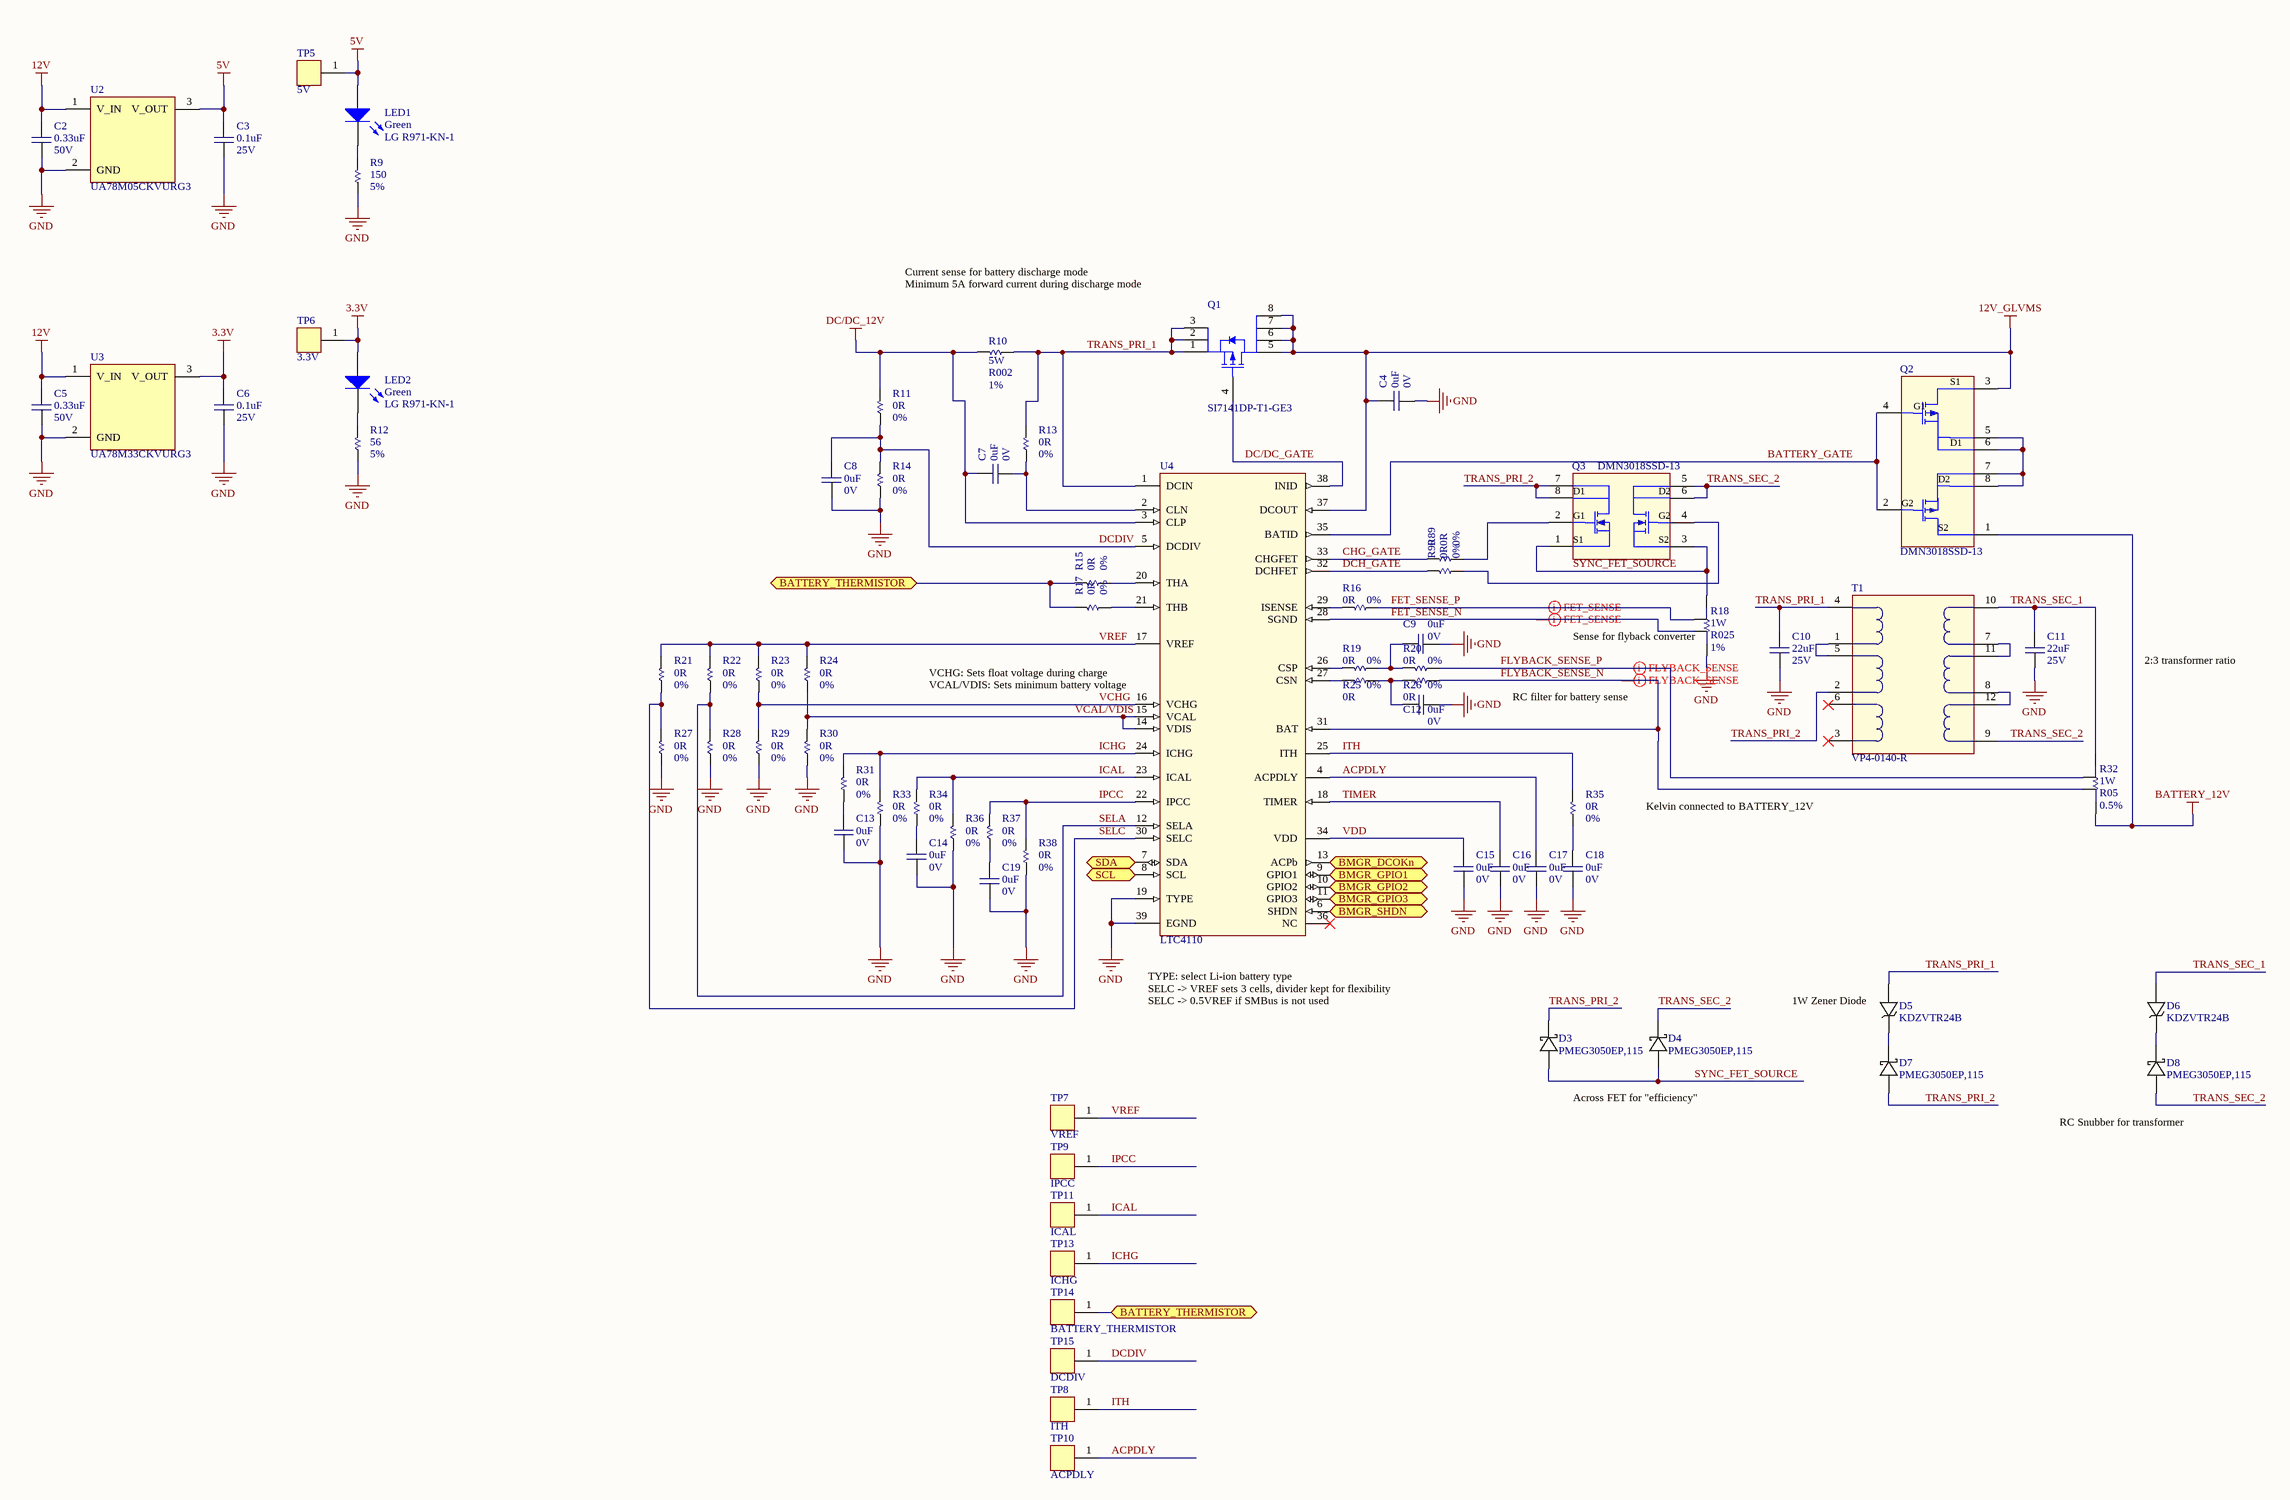
[diagram p6: E17-PDU-POWER.SchDoc]

### Parts
C2  value 0.33uF  Voltage: 50V  [C0805]  (hidden comment: C_0805_Generic)
C3  value 0.1uF  Voltage: 25V  [C0805]  (hidden comment: C_0805_Generic)
C4  value 0uF  Voltage: 0V  [C0603]  (hidden comment: C_0603_Generic_1)
C5  value 0.33uF  Voltage: 50V  [C0805]  (hidden comment: C_0805_Generic)
C6  value 0.1uF  Voltage: 25V  [C0805]  (hidden comment: C_0805_Generic)
C7  value 0uF  Voltage: 0V  [C0603]  (hidden comment: C_0603_Generic_1)
C8  value 0uF  Voltage: 0V  [C0603]  (hidden comment: C_0603_Generic_1)
C9  value 0uF  Voltage: 0V  [C0402]  (hidden comment: C_0403_Generic)
C10  value 22uF  Voltage: 25V  [C0805]  (hidden comment: C_0805_Generic)
C11  value 22uF  Voltage: 25V  [C0805]  (hidden comment: C_0805_Generic)
C12  value 0uF  Voltage: 0V  [C0402]  (hidden comment: C_0403_Generic)
C13  value 0uF  Voltage: 0V  [C0402]  (hidden comment: C_0403_Generic)
C14  value 0uF  Voltage: 0V  [C0402]  (hidden comment: C_0403_Generic)
C15  value 0uF  Voltage: 0V  [C0603]  (hidden comment: C_0603_Generic_1)
C16  value 0uF  Voltage: 0V  [C0402]  (hidden comment: C_0403_Generic)
C17  value 0uF  Voltage: 0V  [C0402]  (hidden comment: C_0403_Generic)
C18  value 0uF  Voltage: 0V  [C0402]  (hidden comment: C_0403_Generic)
C19  value 0uF  Voltage: 0V  [C0402]  (hidden comment: C_0403_Generic)
D3  MFG_PN: PMEG3050EP,115  [SOD-128]  (hidden comment: D_PMEG3050EP,115)
D4  MFG_PN: PMEG3050EP,115  [SOD-128]  (hidden comment: D_PMEG3050EP,115)
D5  MFG_PN: KDZVTR24B  [SOD-123FL]  (hidden comment: D_ZENER)
D6  MFG_PN: KDZVTR24B  [SOD-123FL]  (hidden comment: D_ZENER)
D7  MFG_PN: PMEG3050EP,115  [SOD-128]  (hidden comment: D_PMEG3050EP,115)
D8  MFG_PN: PMEG3050EP,115  [SOD-128]  (hidden comment: D_PMEG3050EP,115)
LED1  Green  MFG_PN: LG R971-KN-1  [LGR971]
LED2  Green  MFG_PN: LG R971-KN-1  [LGR971]
Q1  MFG_PN: SI7141DP-T1-GE3  [PowerPak SO-8]  (hidden comment: Q_SI7141DP-T1-GE3)
Q2  MFG_PN: DMN3018SSD-13  [8-SOIC]  (hidden comment: Q_DMN3018SSD-13_1)
Q3  MFG_PN: DMN3018SSD-13  [8-SOIC]  (hidden comment: Q_DMN3018SSD-13)
R9  value 150  Tolerance: 5%  [R0805]  (hidden comment: R_0805_Generic)
R10  value R002  Power: 5W  Tolerance: 1%  [R2526]  (hidden comment: R_ERJ-MS6SF2M0U)
R11  value 0R  Tolerance: 0%  [R0603]  (hidden comment: R_0603_Generic)
R12  value 56  Tolerance: 5%  [R0805]  (hidden comment: R_0805_Generic)
R13  value 0R  Tolerance: 0%  [R0603]  (hidden comment: R_0603_Generic)
R14  value 0R  Tolerance: 0%  [R0603]  (hidden comment: R_0603_Generic)
R15  value 0R  Tolerance: 0%  [R0603]  (hidden comment: R_0603_Generic)
R16  value 0R  Tolerance: 0%  [R0402]  (hidden comment: R_0402_Generic)
R17  value 0R  Tolerance: 0%  [R0603]  (hidden comment: R_0603_Generic)
R18  value R025  Power: 1W  Tolerance: 1%  [R2512]  (hidden comment: R_LVK24R025FER)
R19  value 0R  Tolerance: 0%  [R0402]  (hidden comment: R_0402_Generic)
R20  value 0R  Tolerance: 0%  [R0402]  (hidden comment: R_0402_Generic)
R21  value 0R  Tolerance: 0%  [R0402]  (hidden comment: R_0402_Generic)
R22  value 0R  Tolerance: 0%  [R0402]  (hidden comment: R_0402_Generic)
R23  value 0R  Tolerance: 0%  [R0402]  (hidden comment: R_0402_Generic)
R24  value 0R  Tolerance: 0%  [R0402]  (hidden comment: R_0402_Generic)
R25  value 0R  Tolerance: 0%  [R0402]  (hidden comment: R_0402_Generic)
R26  value 0R  Tolerance: 0%  [R0402]  (hidden comment: R_0402_Generic)
R27  value 0R  Tolerance: 0%  [R0402]  (hidden comment: R_0402_Generic)
R28  value 0R  Tolerance: 0%  [R0402]  (hidden comment: R_0402_Generic)
R29  value 0R  Tolerance: 0%  [R0402]  (hidden comment: R_0402_Generic)
R30  value 0R  Tolerance: 0%  [R0402]  (hidden comment: R_0402_Generic)
R31  value 0R  Tolerance: 0%  [R0402]  (hidden comment: R_0402_Generic)
R32  value R05  Power: 1W  Tolerance: 0.5%  [R2512]  (hidden comment: R_LVK24R050DER)
R33  value 0R  Tolerance: 0%  [R0402]  (hidden comment: R_0402_Generic)
R34  value 0R  Tolerance: 0%  [R0402]  (hidden comment: R_0402_Generic)
R35  value 0R  Tolerance: 0%  [R0402]  (hidden comment: R_0402_Generic)
R36  value 0R  Tolerance: 0%  [R0402]  (hidden comment: R_0402_Generic)
R37  value 0R  Tolerance: 0%  [R0402]  (hidden comment: R_0402_Generic)
R38  value 0R  Tolerance: 0%  [R0402]  (hidden comment: R_0402_Generic)
R89  value 0R  Tolerance: 0%  [R0603]  (hidden comment: R_0603_Generic)
R90  value 0R  Tolerance: 0%  [R0603]  (hidden comment: R_0603_Generic)
T1  MFG_PN: VP4-0140-R  [T_VP4-0140-R]  (hidden comment: T_VP4-0140-R)
TP5  5V  [TEST POINT]
TP6  3.3V  [TEST POINT]
TP7  VREF  [TEST POINT]
TP8  ITH  [TEST POINT]
TP9  IPCC  [TEST POINT]
TP10  ACPDLY  [TEST POINT]
TP11  ICAL  [TEST POINT]
TP13  ICHG  [TEST POINT]
TP14  BATTERY_THERMISTOR  [TEST POINT]
TP15  DCDIV  [TEST POINT]
U2  MFG_PN: UA78M05CKVURG3  [TO-252-3]  (hidden comment: U_UA78M05CKVURG3)
U3  MFG_PN: UA78M33CKVURG3  [TO-252-3]  (hidden comment: U_UA78M33CKVURG3)
U4  MFG_PN: LTC4110  [U_LTC4110]  (hidden comment: U_LTC4110)

### Ports
BATTERY_THERMISTOR, BMGR_DCOKn, BMGR_GPIO1, BMGR_GPIO2, BMGR_GPIO3, BMGR_SHDN, SCL, SDA

### Nets
3.3V: C6.1(EGND) LED2.1(A) TP6.1 U3.3(V_OUT)
5V: C3.1(EGND) LED1.1(A) TP5.1 U2.3(V_OUT)
12V: C2.1(EGND) C5.1(EGND) U2.1(V_IN) U3.1(V_IN)
12V_GLVMS: C4.1(EGND) Q1.5 Q1.6 Q1.7 Q1.8 Q2.3 U4.37(DCOUT)
BATTERY_12V: Q2.1 R32.1
DC/DC_12V: C7.1(EGND) R10.1 R11.1 U4.3(CLP)
GND: C2.2 C3.2 C4.2 C5.2 C6.2 C8.2 C9.2 C10.2 C11.2 C12.1(EGND) C13.2 C14.2 C15.2 C16.2 C17.2 C18.2 C19.2 R9.2 R12.2 R14.2 R18.1 R27.2 R28.2 R29.2 R30.2 R33.2 R36.2 R38.2 U2.2(GND) U3.2(GND) U4.19(TYPE) U4.39(EGND)
ACPDLY: C17.1(EGND) TP10.1 U4.4(ACPDLY)
BATTERY_GATE: Q2.2 Q2.4 U4.35(BATID)
CHG_GATE: R89.1 U4.33(CHGFET)
DC/DC_GATE: Q1.4(G) U4.38(INID)
DCDIV: C8.1(EGND) R11.2 R14.1 TP15.1 U4.5(DCDIV)
DCH_GATE: R90.1 U4.32(DCHFET)
FET_SENSE_N: R18.3 U4.28(SGND)
FET_SENSE_P: R16.2 R18.4
FLYBACK_SENSE_N: R26.2 R32.3 U4.31(BAT)
FLYBACK_SENSE_P: R20.2 R32.4
ICAL: R34.1 R36.1 TP11.1 U4.23(ICAL)
ICHG: R31.1 R33.1 TP13.1 U4.24(ICHG)
IPCC: R37.1 R38.1 TP9.1 U4.22(IPCC)
ITH: R35.1 TP8.1 U4.25(ITH)
SELA: R22.2 R28.1 U4.12(SELA)
SELC: R21.2 R27.1 U4.30(SELC)
SYNC_FET_SOURCE: D3.1 D4.1 Q3.1 Q3.3 R18.2
TIMER: C16.1(EGND) U4.18(TIMER)
TRANS_PRI_1: C10.1(EGND) D5.1 Q1.1 Q1.2 Q1.3 R10.2 R13.1 T1.4 U4.1(DCIN)
TRANS_PRI_2: D3.2 D7.1 Q3.7 Q3.8 T1.2
TRANS_SEC_1: C11.1(EGND) D6.1 R32.2 T1.10
TRANS_SEC_2: D4.2 D8.1 Q3.5 Q3.6 T1.9
VCAL/VDIS: R24.2 R30.1 U4.14(VDIS) U4.15(VCAL)
VCHG: R23.2 R29.1 U4.16(VCHG)
VDD: C15.1(EGND) U4.34(VDD)
VREF: R21.1 R22.1 R23.1 R24.1 TP7.1 U4.17(VREF)
NetC7_2: C7.2 R13.2 U4.2(CLN)
NetC9_1: C9.1(EGND) R19.2 R20.1
NetC12_2: C12.2 R25.2 R26.1
NetC13_1: C13.1(EGND) R31.2
NetC14_1: C14.1(EGND) R34.2
NetC18_1: C18.1(EGND) R35.2
NetC19_1: C19.1(EGND) R37.2
NetD5_2: D5.2 D7.2
NetD6_2: D6.2 D8.2
NetJ2_34: R15.1 R17.1 TP14.1 ; port BATTERY_THERMISTOR
NetLED1_2: LED1.2(K) R9.1
NetLED2_2: LED2.2(K) R12.1
NetPB1_36: U4.8(SCL) ; port SCL
NetPB1_38: U4.7(SDA) ; port SDA
NetPB1_56: U4.13(ACPb) ; port BMGR_DCOKn
NetPB1_58: U4.11(GPIO3) ; port BMGR_GPIO3
NetPB1_60: U4.10(GPIO2) ; port BMGR_GPIO2
NetPB1_62: U4.9(GPIO1) ; port BMGR_GPIO1
NetPB1_64: U4.6(SHDN) ; port BMGR_SHDN
NetQ2_5: Q2.5 Q2.6 Q2.7 Q2.8
NetQ3_2: Q3.2 R89.2
NetQ3_4: Q3.4 R90.2
NetR15_2: R15.2 U4.20(THA)
NetR16_1: R16.1 U4.29(ISENSE)
NetR17_2: R17.2 U4.21(THB)
NetR19_1: R19.1 U4.26(CSP)
NetR25_1: R25.1 U4.27(CSN)
NetT1_1: T1.1 T1.5
NetT1_7: T1.7 T1.11
NetT1_8: T1.8 T1.12

Not connected (* = marked no-connect by the designer): T1 3* 6*; U4 36(NC)*

### Layout directives
differential pair: FET_SENSE_N, FET_SENSE_P, FLYBACK_SENSE_N, FLYBACK_SENSE_P

### Notes on the sheet
- Current sense for battery discharge mode
- Minimum 5A forward current during discharge mode
- (near R18) Sense for flyback converter
- (near U4) VCAL/VDIS: Sets minimum battery voltage
- (near U4) VCHG: Sets float voltage during charge
- RC filter for battery sense
- 2:3 transformer ratio
- Kelvin connected to BATTERY_12V
- TYPE: select Li-ion battery type
- SELC -> VREF sets 3 cells, divider kept for flexibility
- SELC -> 0.5VREF if SMBus is not used
- (near D5) 1W Zener Diode
- Across FET for "efficiency"
- (near D8) RC Snubber for transformer
- (in symbol Q_DMN3018SSD-13) D1; D2; G1; G2; S1; S2
- (in symbol Q_DMN3018SSD-13_1) S1; G1; D1; D2; G2; S2

### Library data of the parts
C2 C3 C5 C6 = C_0805_Generic: Generic 0805 Capacitor; Tolerance: 10%; Supplier: Digikey
  C2 C5: Supplier_PN: 1276-1123-1-ND
  C3 C6: Supplier_PN: 1276-1099-1-ND
C4 C7 C8 C15 = C_0603_Generic_1: Generic 0603 Capacitor; Tolerance: 0%; Supplier: Digikey; Supplier_PN: 000-000-00-ND
C9 C12-C14 C16-C19 = C_0403_Generic: Generic 0402 Capacitor; Tolerance: 0%; Supplier: Digikey; Supplier_PN: 000-000-00-ND
C10 C11 = C_0805_Generic: Generic 0805 Capacitor; Tolerance: 20%; Supplier: Digikey; Supplier_PN: 490-12389-1-ND
D3 D4 D7 D8 = D_PMEG3050EP,115: DIODE SCHOTTKY 360mV 30V 5A; MFG: Nexperia; Supplier: Digikey; Supplier_PN: 1727-5317-1-ND
D5 D6 = D_ZENER: DIODE ZENER 24V 1W PMDU; MFG: Rohm Semiconductor; Supplier: Digikey; Supplier_PN: KDZVTR24BCT-ND
LED1 LED2 = LED_LGR971: Green LED; MFG: OSRAM Opto Semiconductors Inc.; Supplier: Digikey; Supplier_PN: 475-1410-1-ND
Q1 = Q_SI7141DP-T1-GE3: P-CH 20V 60A PowerPak SO-8; MFG: Vishay; Supplier: Digikey; Supplier_PN: SI7141DP-T1-GE3CT-ND
Q2 = Q_DMN3018SSD-13_1: 2x P-ch FET 40V 6.7A; MFG: ON Semiconductor; Supplier: Digikey; Supplier_PN: NTMD5838NLR2GOSCT-ND
Q3 = Q_DMN3018SSD-13: 2x N-ch FET 40V 6.7A; MFG: ON Semiconductor; Supplier: Digikey; Supplier_PN: NTMD5838NLR2GOSCT-ND
R9 R12 = R_0805_Generic: Generic 0805 Resistor; Power: 1/8W; Supplier: Digikey
  R9: Supplier_PN: P150ACT-ND
  R12: Supplier_PN: P56ACT-ND
R10 = R_ERJ-MS6SF2M0U: RES CURRENT SENSE R002 1% 5W; MFG: Panasonic; Supplier: Digikey; Supplier_PN: P17101CT-ND; MFG_PN: ERJ-MS6SF2M0U
R11 R13-R15 R17 R89 R90 = R_0603_Generic: Generic 0603 Resistor; Power: 0W; Supplier: Digikey; Supplier_PN: 000-00-00-ND
R16 R19-R31 R33-R38 = R_0402_Generic: Generic 0402 Resistor; Power: 0W; Supplier: Digikey; Supplier_PN: 000-00-00-ND
R18 = R_LVK24R025FER: RES CURRENT SENSE R025 1% 1W; MFG: Ohmite; Supplier: Digikey; Supplier_PN: LVK24R025FERCT-ND; MFG_PN: LVK24R025FER
R32 = R_LVK24R050DER: RES CURRENT SENSE R05 0.5% 1W; MFG: Ohmite; Supplier: Digikey; Supplier_PN: LVK24R050DERCT-ND; MFG_PN: LVK24R050DER
T1 = T_VP4-0140-R: Transformer 6 coil 11.3uH; MFG: Eaton; Supplier: Digikey; Supplier_PN: 513-1558-ND
TP5-TP11 TP13-TP15 = Test Point
U2 = U_UA78M05CKVURG3: 5V 500mA Linear Regulator; MFG: TI; Supplier: Digikey; Supplier_PN: 296-19755-1-ND
U3 = U_UA78M33CKVURG3: 3.3V 500mA Linear Regulator; MFG: TI; Supplier: Digikey; Supplier Part Number: 296-21208-1-ND
U4 = U_LTC4110: IC Battery Backup Manager; MFG: Linear Technology; Supplier_PN: LTC4110EUHF#PBF-ND; Supplier: Digikey

## Nets that join several sheets
3.3V: E17-PDU-PROCESSOR (14 pins), E17-PDU-POWER (C6.1 LED2.1 TP6.1 U3.3)
5V: E17-PDU-CONNECTORS (C1.2 U1.8), E17-PDU-POWER (C3.1 LED1.1 TP5.1 U2.3)
12V: E17-PDU-CONNECTORS (F4.2 J1.5 R4.2), E17-PDU-LOAD_1 (5 pins), E17-PDU-LOAD_2 (5 pins), E17-PDU-LOAD_3 (5 pins), E17-PDU-POWER (C2.1 C5.1 U2.1 U3.1)
12V_GLVMS: E17-PDU-CONNECTORS (F3.2 J1.2), E17-PDU-POWER (7 pins)
BATTERY_12V: E17-PDU-CONNECTORS (D2.2 F2.2), E17-PDU-POWER (Q2.1 R32.1)
DC/DC_12V: E17-PDU-CONNECTORS (D1.2 F1.2), E17-PDU-POWER (C7.1 R10.1 R11.1 U4.3)
GND: E17-PDU-CONNECTORS (28 pins), E17-PDU-PROCESSOR (6 pins), E17-PDU-LOAD_1 (12 pins), E17-PDU-LOAD_2 (12 pins), E17-PDU-LOAD_3 (12 pins), E17-PDU-POWER (32 pins)
CAN_N: E17-PDU-CONNECTORS (P1.5 TP4.1), E17-PDU-PROCESSOR (PB1.19)
CAN_P: E17-PDU-CONNECTORS (P1.4 TP3.1), E17-PDU-PROCESSOR (PB1.17)
NetF5_2: E17-PDU-CONNECTORS (J2.3), E17-PDU-LOAD_1 (F5.2)
NetF6_2: E17-PDU-CONNECTORS (J2.1), E17-PDU-LOAD_1 (F6.2)
NetF7_2: E17-PDU-CONNECTORS (J2.13), E17-PDU-LOAD_1 (F7.2)
NetF8_2: E17-PDU-CONNECTORS (J2.24), E17-PDU-LOAD_1 (F8.2)
NetF9_2: E17-PDU-CONNECTORS (J2.9), E17-PDU-LOAD_2 (F9.2)
NetF10_2: E17-PDU-CONNECTORS (J2.7), E17-PDU-LOAD_2 (F10.2)
NetF11_2: E17-PDU-CONNECTORS (J2.6), E17-PDU-LOAD_2 (F11.2)
NetF12_2: E17-PDU-CONNECTORS (J2.4), E17-PDU-LOAD_2 (F12.2)
NetF13_2: E17-PDU-CONNECTORS (J2.35), E17-PDU-LOAD_3 (F13.2)
NetF14_2: E17-PDU-CONNECTORS (J2.23), E17-PDU-LOAD_3 (F14.2)
NetF15_2: E17-PDU-CONNECTORS (J2.12), E17-PDU-LOAD_3 (F15.2)
NetF16_2: E17-PDU-CONNECTORS (J2.10), E17-PDU-LOAD_3 (F16.2)
NetJ2_34: E17-PDU-CONNECTORS (J2.34), E17-PDU-POWER (R15.1 R17.1 TP14.1)
NetPB1_16: E17-PDU-CONNECTORS (R5.2 TP2.1), E17-PDU-PROCESSOR (PB1.16)
NetPB1_18: E17-PDU-PROCESSOR (PB1.18), E17-PDU-LOAD_2 (R65.1)
NetPB1_20: E17-PDU-PROCESSOR (PB1.20), E17-PDU-LOAD_2 (R66.1)
NetPB1_22: E17-PDU-PROCESSOR (PB1.22), E17-PDU-LOAD_2 (R67.1)
NetPB1_24: E17-PDU-PROCESSOR (PB1.24), E17-PDU-LOAD_2 (R68.1)
NetPB1_25: E17-PDU-CONNECTORS (R2.2 TP1.1), E17-PDU-PROCESSOR (PB1.25)
NetPB1_26: E17-PDU-PROCESSOR (PB1.26), E17-PDU-LOAD_1 (R52.1)
NetPB1_27: E17-PDU-PROCESSOR (PB1.27), E17-PDU-LOAD_3 (R81.1)
NetPB1_28: E17-PDU-PROCESSOR (PB1.28), E17-PDU-LOAD_1 (R51.1)
NetPB1_29: E17-PDU-PROCESSOR (PB1.29), E17-PDU-LOAD_3 (R82.1)
NetPB1_30: E17-PDU-PROCESSOR (PB1.30), E17-PDU-LOAD_1 (R50.1)
NetPB1_31: E17-PDU-PROCESSOR (PB1.31), E17-PDU-LOAD_3 (R83.1)
NetPB1_32: E17-PDU-PROCESSOR (PB1.32), E17-PDU-LOAD_1 (R49.1)
NetPB1_33: E17-PDU-PROCESSOR (PB1.33), E17-PDU-LOAD_3 (R84.1)
NetPB1_36: E17-PDU-PROCESSOR (PB1.36 R8.1), E17-PDU-POWER (U4.8)
NetPB1_38: E17-PDU-PROCESSOR (PB1.38 R7.1), E17-PDU-POWER (U4.7)
NetPB1_39: E17-PDU-PROCESSOR (PB1.39), E17-PDU-LOAD_2 (R57.2 R60.1)
NetPB1_40: E17-PDU-PROCESSOR (PB1.40), E17-PDU-LOAD_3 (R73.2 R76.1)
NetPB1_41: E17-PDU-PROCESSOR (PB1.41), E17-PDU-LOAD_2 (R58.2 R61.1)
NetPB1_42: E17-PDU-PROCESSOR (PB1.42), E17-PDU-LOAD_3 (R74.2 R77.1)
NetPB1_44: E17-PDU-PROCESSOR (PB1.44), E17-PDU-LOAD_3 (R75.2 R79.1)
NetPB1_46: E17-PDU-PROCESSOR (PB1.46), E17-PDU-LOAD_3 (R78.2 R80.1)
NetPB1_47: E17-PDU-PROCESSOR (PB1.47), E17-PDU-LOAD_2 (R59.2 R63.1)
NetPB1_49: E17-PDU-PROCESSOR (PB1.49), E17-PDU-LOAD_2 (R62.2 R64.1)
NetPB1_53: E17-PDU-PROCESSOR (PB1.53), E17-PDU-LOAD_1 (R41.2 R44.1)
NetPB1_55: E17-PDU-PROCESSOR (PB1.55), E17-PDU-LOAD_1 (R42.2 R45.1)
NetPB1_56: E17-PDU-PROCESSOR (PB1.56 R95.2), E17-PDU-POWER (U4.13)
NetPB1_57: E17-PDU-PROCESSOR (PB1.57), E17-PDU-LOAD_1 (R43.2 R47.1)
NetPB1_58: E17-PDU-PROCESSOR (PB1.58 R94.2), E17-PDU-POWER (U4.11)
NetPB1_59: E17-PDU-PROCESSOR (PB1.59), E17-PDU-LOAD_1 (R46.2 R48.1)
NetPB1_60: E17-PDU-PROCESSOR (PB1.60 R93.2), E17-PDU-POWER (U4.10)
NetPB1_62: E17-PDU-PROCESSOR (PB1.62 R92.2), E17-PDU-POWER (U4.9)
NetPB1_64: E17-PDU-PROCESSOR (PB1.64 R91.2), E17-PDU-POWER (U4.6)